# EasyEDA Pro project ProPrj_nrf52833_LighthouseTag_2025-07-28.epro, board PCB18_3
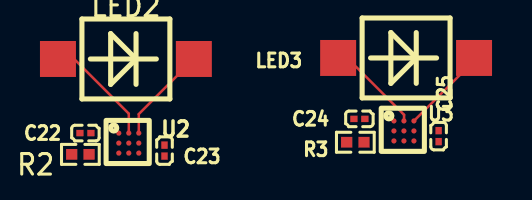
[diagram p13: board, top side]
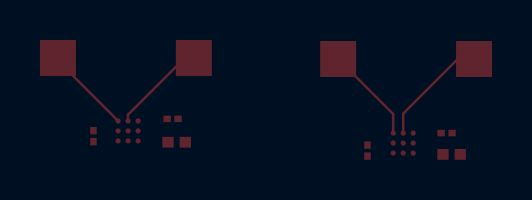
[diagram p14: board, bottom side, seen from below]

No outline. copper layers: Top Layer, Bottom Layer. Coordinates in mm from the lowest, leftmost part position.
Stack: Top Layer 0.035mm / Dielectric1 1.51mm FR4 er 4.5 / Bottom Layer 0.035mm

## Design rules (mm)
template: 用户自定义配置
spacing safeClearance (default): track to track 0.152, other pairs 0.152 to 0.3
track width trackWidth (default): min 0.127, default 0.203, max 1.27
differential pair differentialPair (default): width min 0.127, default 0.254, max 2.54; gap min 0.152, default 0.152
via viaSize (default): diameter min 0.5, default 0.61, max 10; hole min 0.3, default 0.305, max 5.999

## Placement (name value [footprint] x y rotation side)
C22  1uF  [C0201]  0.25 1.07 180 top
C23  100nF  [C0201]  4.21 0.19 90 top
C24  1uF  [C0201]  13.96 1.78 180 top
C25  100nF  [C0201]  17.92 0.91 90 top
LED2  VBPW34S  [SENSOR-SMD_L4.4-W3.9]  2.28 4.77 0 top
LED3  VBPW34S  [SENSOR-SMD_L4.4-W3.9]  16.3 4.82 0 top
R2  15kΩ  [R0402]  0 0 0 top
R3  15kΩ  [R0402]  13.76 0.61 0 top
U2  -  [TS4231]  2.43 0.56 0 top
U3  -  [TS4231]  16.2 1.17 0 top

## Footprints (pads in the part's own frame, mm; a bottom-side part is the same pattern mirrored in y, then rotated)
C0201
  rect 0.368x0.324 smd: 1(-0.275,0) 2(0.275,0)
R0402
  rect 0.566x0.54 smd: 1(-0.433,0) 2(0.433,0)
SENSOR-SMD_L4.4-W3.9
  rect 1.8x1.8 smd: 1(-3.4,0) 2(3.4,0)
TS4231
  round 0.262 smd: 1(-0.508,0.508) 2(-0.008,0.508) 3(0.492,0.508) 4(-0.508,0.008) 5(-0.008,0.008) 6(0.492,0.008) 7(-0.508,-0.492) 8(-0.008,-0.492) 9(0.492,-0.492)

## Nets
As in the schematic.

## Routing (per net, layer and track width the routed paths; a pad name or vN(x,y) marks a point on that pad's centre or on a via; arc(x,y) is an arc through that point)
$1N11204: length 4.8
  Top Layer w0.127: LED2.2 2.92,2.02 U2.3
$1N11226: length 5.7
  Top Layer w0.127: LED2.1 -0.31,4.77 2.42,2.04 U2.2
$1N34199: length 4.4
  Top Layer w0.127: LED3.2 19.7,4.68 U3.3
$1N34200: length 4.8
  Top Layer w0.127: LED3.1 13.35,4.82 16.2,1.98 16.2,1.68 U3.2
